# Altium schematic sheet DAC.SchDoc
size A4
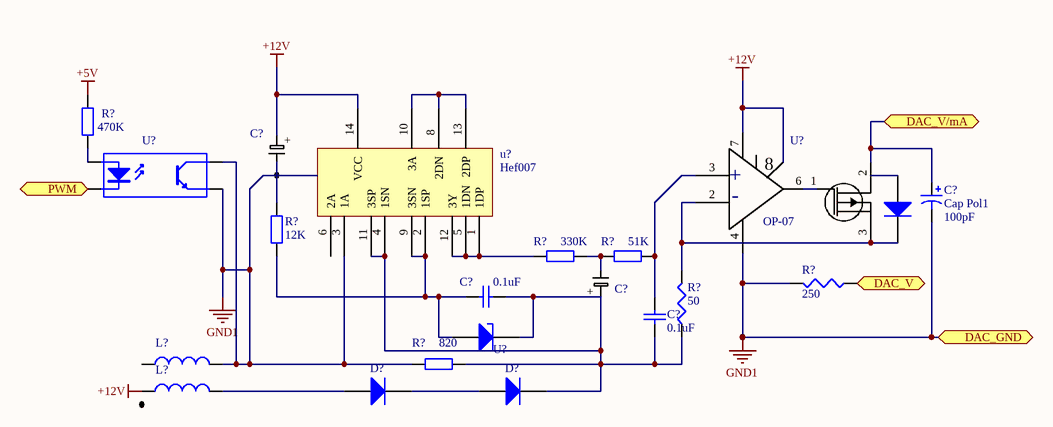
[diagram p0: DAC.SchDoc]

## Parts
(Parts that share a designator on the sheet are numbered #1, #2 ... from top to bottom, then left to right.)
*?#1  Component_1  (value not drawn)
*?#2  Component_1  (value not drawn)
?#1  Component_1  (value not drawn)
?#2  Diode 1N4007  [D#1]  (value not drawn)
C?#1  Component_1  (value not drawn)
C?#2  Cap Pol1  value 100pF  [RB7.6-15]
C?#3  Component_1  (value not drawn)
C?#4  value 0.1uF  [RAD-0.3]  (hidden comment: Cap)
C?#5  value 0.1uF  [RAD-0.3]  (hidden comment: Cap)
D?#1  Diode 1N4007  [D#1]  (value not drawn)
D?#2  Diode 1N4007  [D#1]  (value not drawn)
L?#1  IHLP2525CZER6R8M01/6.8UH  [IHLP2525CZER6R8M01/6.8UH]  (value not drawn)
L?#2  IHLP2525CZER6R8M01/6.8UH  [IHLP2525CZER6R8M01/6.8UH]  (value not drawn)
Q#?  IRF3205  [irf3205]  (value not drawn)
R?#1  value 470K  [AXIAL-0.4]  (hidden comment: Res2)
R?#2  value 12K  [AXIAL-0.4]  (hidden comment: Res2)
R?#3  value 330K  [AXIAL-0.4]  (hidden comment: Res2)
R?#4  value 51K  [AXIAL-0.4]  (hidden comment: Res2)
R?#5  value 250  [J1-0603]  (hidden comment: Res3)
R?#6  value 50  [J1-0603]  (hidden comment: Res3)
R?#7  value 820  [AXIAL-0.4]  (hidden comment: Res2)
U?#1  Optoisolator1  [DIP-4]  (value not drawn)
U?#2  OP-07
u?#3  Hef007
U?#4  SBR3U40P1  [SBR3U40P1]  (value not drawn)

## Ports
DAC_GND, DAC_V, DAC_V/mA, PWM

## Nets
+5V: R?#1.2
+12V: L?#2.1 U?#2.7 u?#3.14(VCC)
GND1: C?#2.2 L?#1.2 R?#5.2 R?#7.1 U?#1.3(E) U?#1.4(C) U?#2.4 u?#3.3(1A) ; port DAC_GND
DAC_V: R?#5.1 ; port DAC_V
DAC_V/mA: C?#2.1 Q#?.2(D) ; port DAC_V/mA
PWM: U?#1.2(K) ; port PWM
Net?#2_2: ?#2.2(K) Q#?.3(S) R?#6.2 U?#2.2
NetC?#4_1: C?#4.1 R?#2.1 u?#3.2(1SP) u?#3.9(3SN) U?#4.1(A)
NetC?#4_2: C?#4.2 C?#5.1 D?#2.2(K) R?#6.1 R?#7.2 u?#3.4(1SN) u?#3.11(3SP) U?#4.2(K)
NetC?#5_2: C?#5.2 R?#4.2
NetD?#1_1: D?#1.1(A) L?#2.2
NetD?#1_2: D?#1.2(K) D?#2.1(A)
NetQ#?_1: Q#?.1 U?#2.6
NetR?#1_1: R?#1.1 U?#1.1(A)
NetR?#3_1: R?#3.1 u?#3.1(1DP) u?#3.5(1DN) u?#3.12(3Y)
NetR?#3_2: R?#3.2 R?#4.1
Netu?#3_8: u?#3.8(2DN) u?#3.10(3A) u?#3.13(2DP)

Not connected (* = marked no-connect by the designer): ?#2 1(A); L?#1 1; R?#2 2; U?#2 3(13) 17; u?#3 6(2A)

## Notes on the sheet
- (in symbol Component_1) +
- (in symbol 运放) 8; +; -

## Library data of the parts
?#2 D?#1 D?#2 = Diode 1N4007: 1 Amp General Purpose Rectifier; Published: 8-Jun-2000; LatestRevisionDate: 17-Jul-2002; LatestRevisionNote: Re-released for DXP Platform.; DatasheetDocument: 1998; PackageDocument: Aug-1999; PackageReference: DO-41; Publisher: Altium Limited; Code_JEDEC: DO-204-AL; ComponentLink1Description: Manufacturer Link; ComponentLink1URL: http://www.fairchildsemi.com/; ComponentLink2Description: Datasheet; ComponentLink2URL: http://www.fairchildsemi.com/ds/1N%2F1N4001.pdf
C?#2 = Cap Pol1: Polarized Capacitor (Radial); Published: 8-Jun-2000; LatestRevisionDate: 17-Jul-2002; LatestRevisionNote: Re-released for DXP Platform.; PackageReference: RB7.6-15; Publisher: Altium Limited; PackageDescription: Polarized Capacitor (Radial); 2 Leads
C?#4 C?#5 = Cap: Capacitor; Published: 8-Jun-2000; LatestRevisionDate: 17-Jul-2002; LatestRevisionNote: Re-released for DXP Platform.; PackageReference: RAD-0.3; Publisher: Altium Limited; PackageDescription: Radial Cap, Thru-Hole; 2 Leads; 0.3 in Pin Spacing
L?#1 L?#2 = Inductor: Code_IEC: 1005; Value: 4.7uh; Published: 8-Jun-2000; LatestRevisionDate: 17-Jul-2002; LatestRevisionNote: Re-released for DXP Platform.; PackageReference: 0402-A; Publisher: Altium Limited; Code_JEITA: 0402
Q#? = PMOS1: N-Channel Power MOSFET; Note: Pin 2 is electrically connected to pin 4.; Published: 8-Jun-2000; LatestRevisionDate: 17-Jul-2002; LatestRevisionNote: Re-released for DXP Platform.; DatasheetVersion: PD-9.814; PackageReference: TO-220AB; Publisher: Altium Limited; Code_JEDEC: TO-220-AB; ComponentLink1Description: Manufacturer Link; ComponentLink1URL: http://www.irf.com/
R?#1-R?#4 R?#7 = Res2: Resistor; Published: 8-Jun-2000; LatestRevisionDate: 17-Jul-2002; LatestRevisionNote: Re-released for DXP Platform.; PackageReference: AXIAL-0.4; Publisher: Altium Limited
R?#5 R?#6 = Res3: Resistor; Published: 8-Jun-2000; LatestRevisionDate: 04-Mar-2005; LatestRevisionNote: PCB Footprint replaced.; PackageReference: J1-0603; Publisher: Altium Limited
U?#1 = Optoisolator1: 4-Pin Phototransistor Optocoupler; Published: 24-Mar-1999; LatestRevisionDate: 04-Mar-2005; LatestRevisionNote: Sch pins 3 & 4 Swapped.; DatasheetVersion: Nov-2003; PackageReference: DIP-4; Publisher: Altium Limited
U?#2 = 运放
u?#3 = Component_1
U?#4 = 稳压管: Zener Diode; Published: 8-Jun-2000; LatestRevisionDate: 17-Jul-2002; LatestRevisionNote: Re-released for DXP Platform.; PackageReference: DIODE-0.7; Publisher: Altium Limited